# Altium schematic sheet Sheet4.SchDoc
size A4
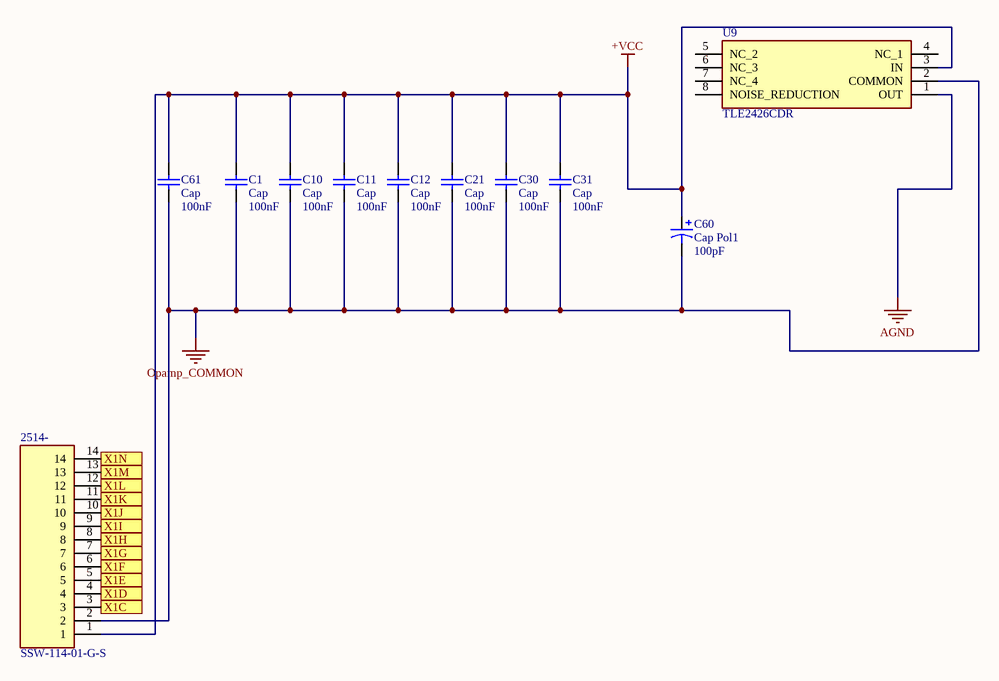
[diagram p0: Sheet4.SchDoc]

## Parts
2514-  SSW-114-01-G-S  [SHDR14W79P0X254_1X14_3607X241X851P]
C1  Cap  value 100nF  [SMD_CAPACITOR]
C10  Cap  value 100nF  [SMD_CAPACITOR]
C11  Cap  value 100nF  [SMD_CAPACITOR]
C12  Cap  value 100nF  [SMD_CAPACITOR]
C21  Cap  value 100nF  [SMD_CAPACITOR]
C30  Cap  value 100nF  [SMD_CAPACITOR]
C31  Cap  value 100nF  [SMD_CAPACITOR]
C60  Cap Pol1  value 100pF  [SMD_POLAR_CAPACITOR]
C61  Cap  value 100nF  [SMD_CAPACITOR]
U9  TLE2426CDR  [SOIC127P600X175-8N]

## Ports
X1C (in), X1D (in), X1E (in), X1F (in), X1G (out), X1H (out), X1I (out), X1J (out), X1K (out), X1L (out), X1M (out), X1N (out)

## Nets
+VCC: 2514-.1 C1.2 C10.2 C11.2 C12.2 C21.2 C30.2 C31.2 C60.1 C61.2 U9.3(IN)
AGND: U9.1(OUT)
Opamp_COMMON: 2514-.2 C1.1 C10.1 C11.1 C12.1 C21.1 C30.1 C31.1 C60.2 C61.1 U9.2(COMMON)
X1C: 2514-.3 ; port X1C
X1D: 2514-.4 ; port X1D
X1E: 2514-.5 ; port X1E
X1F: 2514-.6 ; port X1F
X1G: 2514-.7 ; port X1G
X1H: 2514-.8 ; port X1H
X1I: 2514-.9 ; port X1I
X1J: 2514-.10 ; port X1J
X1K: 2514-.11 ; port X1K
X1L: 2514-.12 ; port X1L
X1M: 2514-.13 ; port X1M
X1N: 2514-.14 ; port X1N

Not connected (* = marked no-connect by the designer): U9 4(NC_1) 5(NC_2) 6(NC_3) 7(NC_4) 8(NOISE_REDUCTION)

## Library data of the parts
2514- = SSW-114-01-G-S: Capacitor; Manufacturer_Name: SAMTEC; Datasheet Link: http://suddendocs.samtec.com/prints/ssw-1xx-xx-xxx-x-xx-xxx-xx-mkt.pdf; Height: 8.51mm; Manufacturer_Part_Number: SSW-114-01-G-S
C1 C10-C12 C21 C30 C31 C61 = Cap: Capacitor; Published: 8-Jun-2000; LatestRevisionDate: 17-Jul-2002; LatestRevisionNote: Re-released for DXP Platform.; PackageReference: RAD-0.3; Publisher: Altium Limited; PackageDescription: Radial Cap, Thru-Hole; 2 Leads; 0.3 in Pin Spacing
C60 = Cap Pol1: Polarized Capacitor (Radial); Published: 8-Jun-2000; LatestRevisionDate: 17-Jul-2002; LatestRevisionNote: Re-released for DXP Platform.; PackageReference: RB7.6-15; Publisher: Altium Limited; PackageDescription: Polarized Capacitor (Radial); 2 Leads
U9 = TLE2426CDR: Integrated Circuit; Manufacturer_Name: Texas Instruments; Datasheet Link: http://www.ti.com/lit/gpn/TLE2426; Height: 1.75mm; Mouser2 Part Number: 595-TLE2426CDR; Mouser2 Price/Stock: https://www.mouser.com/Search/Refine.aspx?Keyword=595-TLE2426CDR; Manufacturer_Part_Number: TLE2426CDR